# EAGLE design snake2 (EAGLE 5.06)
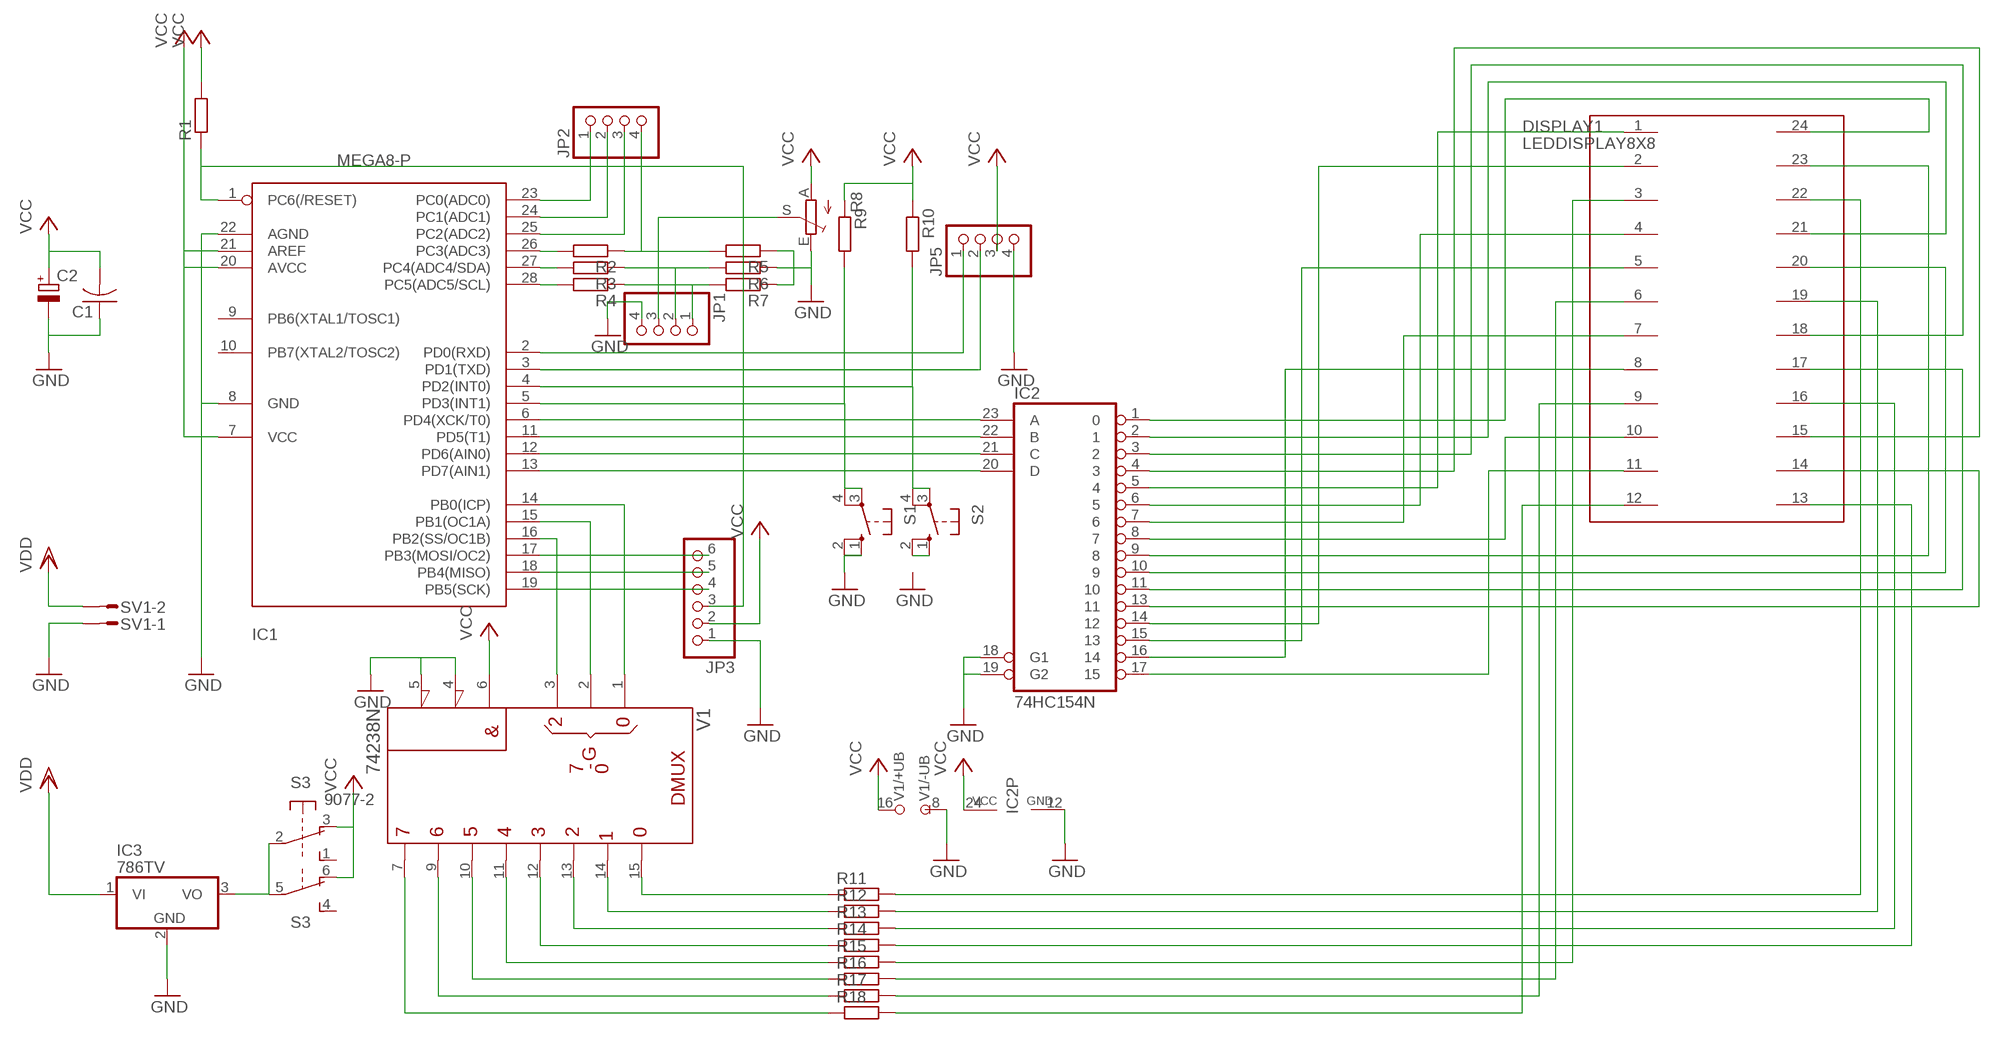
[diagram p0: schematic, sheet 1]

## Parts
C1  C-US050-025X075  [C050-025X075]
C2  CPOL-EUE2,5-6E  [E2,5-6E]
DISPLAY1  LEDDISPLAY8X8  [LEDDISPLAY8X8]
IC1  MEGA8-P  [DIL28-3]
IC2  74HC154N  [DIL24-6]
IC3  786TV  [TO220V]
JP1  PINHD-1X4  [1X04]
JP2  PINHD-1X4  [1X04]
JP3  PINHD-1X6  [1X06]
JP5  PINHD-1X4  [1X04]
R1  R-EU_M0805  [M0805]
R2  R-EU_0309/V  [0309V]
R3  R-EU_0309/V  [0309V]
R4  R-EU_0309/V  [0309V]
R5  R-EU_0309/V  [0309V]
R6  R-EU_0309/V  [0309V]
R7  R-EU_0309/V  [0309V]
R8  TRIM_EU-B25P  [B25P]
R9  R-EU_M0805  [M0805]
R10  R-EU_M0805  [M0805]
R11  R-EU_M0805  [M0805]
R12  R-EU_M0805  [M0805]
R13  R-EU_M0805  [M0805]
R14  R-EU_M0805  [M0805]
R15  R-EU_M0805  [M0805]
R16  R-EU_M0805  [M0805]
R17  R-EU_M0805  [M0805]
R18  R-EU_M0805  [M0805]
S1  10-XX  [B3F-10XX]
S2  10-XX  [B3F-10XX]
S3  9077-2  [9077-2]
SV1  S02P  [S02P]
V1  74238N  [DIL16]

## Nets
GND [power]: C1.1 C2.- IC1.8(GND) IC1.22(AGND) IC2.12(GND) IC2.18(G1) IC2.19(G2) IC3.2(GND) JP1.4 JP3.1 JP5.4 R5.1 R6.1 R7.1 R8.E S1.1(S) S1.2(S1) SV1.1 V1.4(!G2A) V1.5(!G2B) V1.8(-UB)
N$1: IC1.1(PC6(/RESET)) JP3.3 R1.1
N$2: IC1.26(PC3(ADC3)) R2.2
N$3: IC1.27(PC4(ADC4/SDA)) R3.2
N$4: IC1.28(PC5(ADC5/SCL)) R4.2
N$5: JP1.3 R8.S
N$6: JP2.4 R2.1 R5.2
N$7: JP1.2 R3.1 R6.2
N$8: JP1.1 R4.1 R7.2
N$9: IC1.23(PC0(ADC0)) JP2.1
N$10: IC1.24(PC1(ADC1)) JP2.2
N$11: IC1.25(PC2(ADC2)) JP2.3
N$12: IC1.13(PD7(AIN1)) IC2.20(D)
N$13: IC1.12(PD6(AIN0)) IC2.21(C)
N$14: IC1.11(PD5(T1)) IC2.22(B)
N$15: IC1.6(PD4(XCK/T0)) IC2.23(A)
N$16: IC1.19(PB5(SCK)) JP3.4
N$17: IC1.18(PB4(MISO)) JP3.5
N$18: IC1.17(PB3(MOSI/OC2)) JP3.6
N$19 [power]: IC3.3(VO) S3.2(1:P) S3.5(2:P)
N$20: IC1.16(PB2(SS/OC1B)) V1.3(C)
N$21: IC1.15(PB1(OC1A)) V1.2(B)
N$22: IC1.14(PB0(ICP)) V1.1(A)
N$23: IC1.5(PD3(INT1)) R9.2 S1.3(P) S1.4(P1)
N$24: DISPLAY1.22 R11.2
N$25: IC1.4(PD2(INT0)) R10.2 S2.3(P) S2.4(P1)
N$26: S2.1(S) S2.2(S1)
N$27: DISPLAY1.19 R12.2
N$28: DISPLAY1.16 R13.2
N$29: DISPLAY1.13 R14.2
N$30: DISPLAY1.3 R15.2
N$31: DISPLAY1.6 R16.2
N$32: DISPLAY1.9 R17.2
N$33: DISPLAY1.12 R18.2
N$34: DISPLAY1.24 IC2.1
N$35: DISPLAY1.23 IC2.9
N$36: DISPLAY1.21 IC2.2
N$37: DISPLAY1.20 IC2.10
N$38: DISPLAY1.18 IC2.3
N$39: DISPLAY1.17 IC2.11
N$40: DISPLAY1.15 IC2.4
N$41: DISPLAY1.14 IC2.13
N$42: DISPLAY1.1 IC2.5
N$43: DISPLAY1.2 IC2.14
N$44: DISPLAY1.4 IC2.6
N$45: DISPLAY1.5 IC2.15
N$46: DISPLAY1.7 IC2.7
N$47: DISPLAY1.8 IC2.16
N$48: DISPLAY1.10 IC2.8
N$49: DISPLAY1.11 IC2.17
N$50: R18.1 V1.7(Y7)
N$51: R17.1 V1.9(Y6)
N$52: R16.1 V1.10(Y5)
N$53: R15.1 V1.11(Y4)
N$54: R14.1 V1.12(Y3)
N$55: R13.1 V1.13(Y2)
N$56: R12.1 V1.14(Y1)
N$57: R11.1 V1.15(Y0)
N$58: IC1.2(PD0(RXD)) JP5.1
N$59: IC1.3(PD1(TXD)) JP5.2
VCC [power]: C1.2 C2.+ IC1.7(VCC) IC1.20(AVCC) IC1.21(AREF) IC2.24(VCC) JP3.2 JP5.3 R1.2 R8.A R9.1 R10.1 S3.3(1:O) S3.6(2:O) V1.6(G1) V1.16(+UB)
VDD [power]: IC3.1(VI) SV1.2
Unconnected: IC1.9(PB6(XTAL1/TOSC1)) IC1.10(PB7(XTAL2/TOSC2)) S3.1(1:S) S3.4(2:S)

## Library data of the parts
C1 = rcl:C-US: CAPACITOR, American symbol
C2 = rcl:CPOL-EU: POLARIZED CAPACITOR, European symbol
DISPLAY1 = displayled8x8:LEDDISPLAY8X8
IC1 = atmel:MEGA8-P: MICROCONTROLLER 8 Kbytes FLASH, 1 kbytes SRAM, 512 bytes EEPROM, USART, 4-channel 10 bit ADC, 2-channel 8 bit ADC Pin compatible with Atmega48, ATMega88, ATMega168 Source: avr.lbr
IC2 = 74xx-eu:74*154: 4-line to 16-line data SELECTOR/MULTIPLEXER
IC3 = linear:78*: Positive VOLTAGE REGULATOR Source: http://cache.national.com/ds/LM/LM78L05.pdf http://www.fairchildsemi.com/ds/LM/LM7805.pdf
JP1 JP2 JP5 = pinhead:PINHD-1X4: PIN HEADER
JP3 = pinhead:PINHD-1X6: PIN HEADER
R1-R7 R9-R18 = rcl:R-EU_: RESISTOR, European symbol
R8 = pot:TRIM_EU-: POTENTIOMETER
S1 S2 = switch-omron:10-XX: OMRON SWITCH
S3 = switch-misc:9077-2: MARQUARDT SWITCH
SV1 = con-amp-mt:S02P: AMP MT CONNECTOR
V1 = 74ttl-din:74*238: 1 of 8 noninverting DECODER/DEMULTIPLEXER

## Net classes
0 default: width 0.406 mm, clearance 0.254 mm
1 power: width 0.61 mm, clearance 0.254 mm to class 0, clearance 0.508 mm

## Board
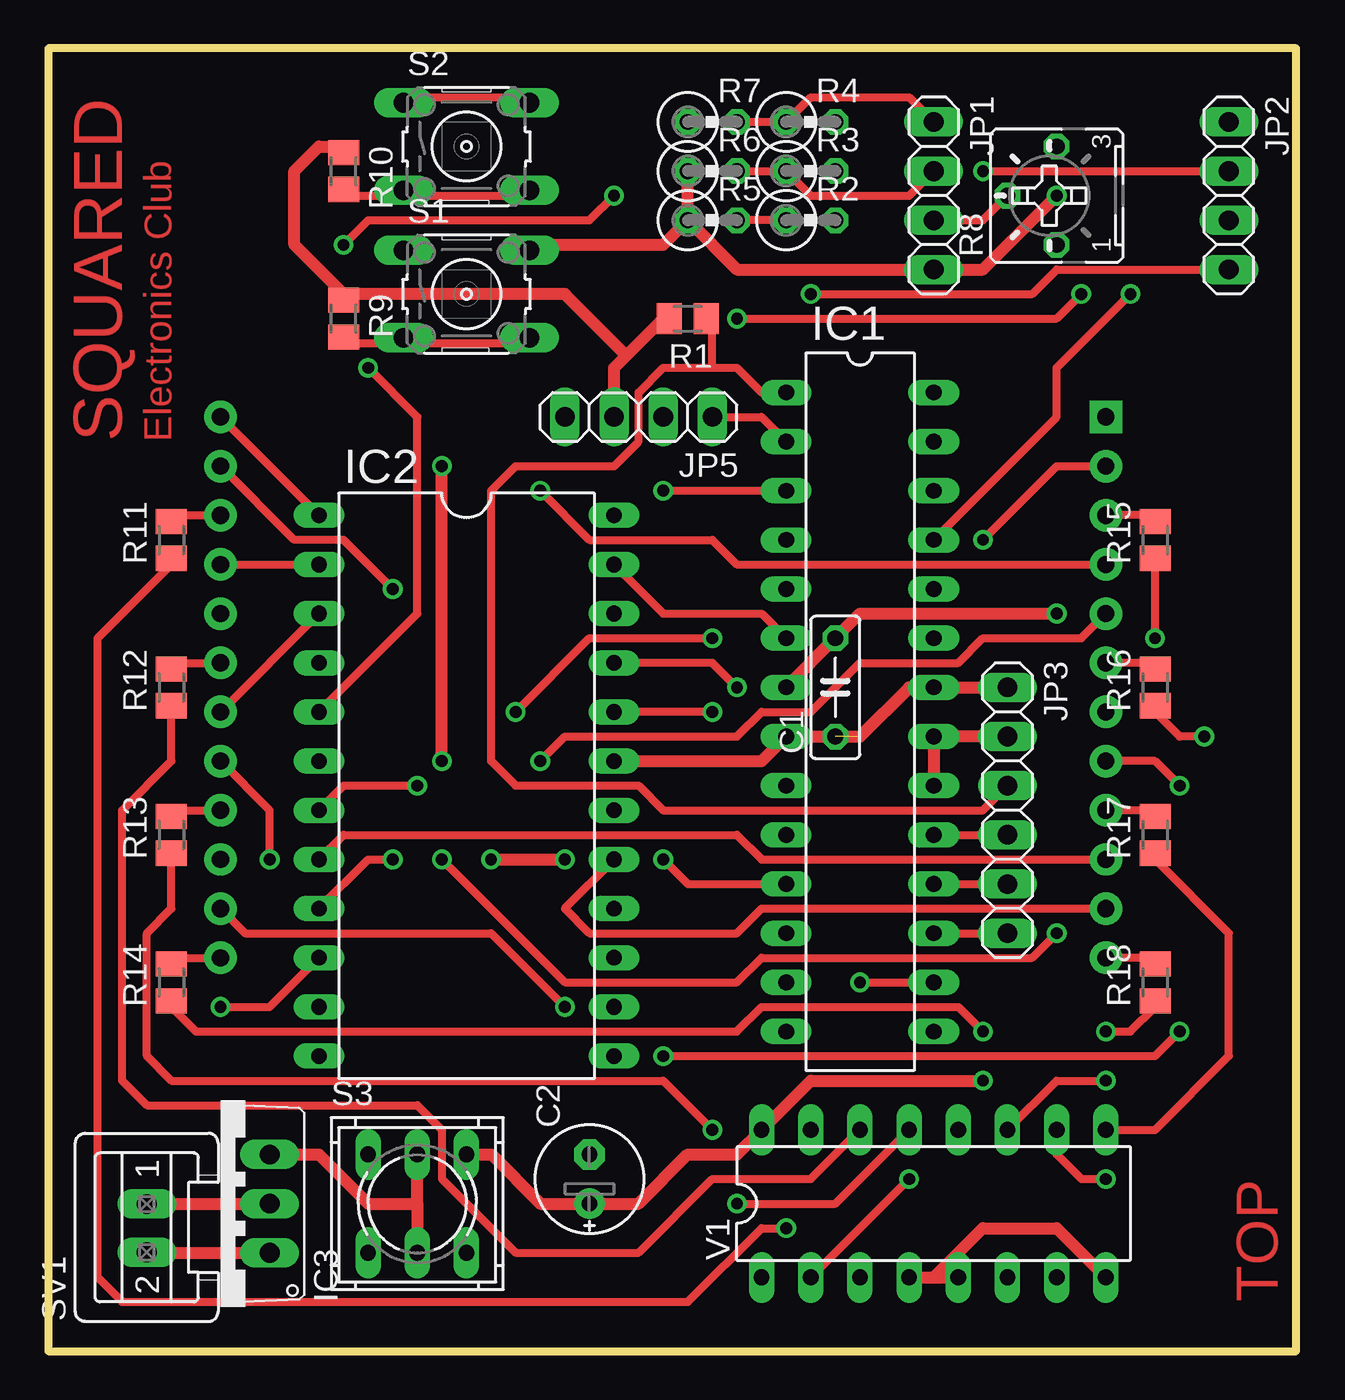
[diagram p1: board, top side]
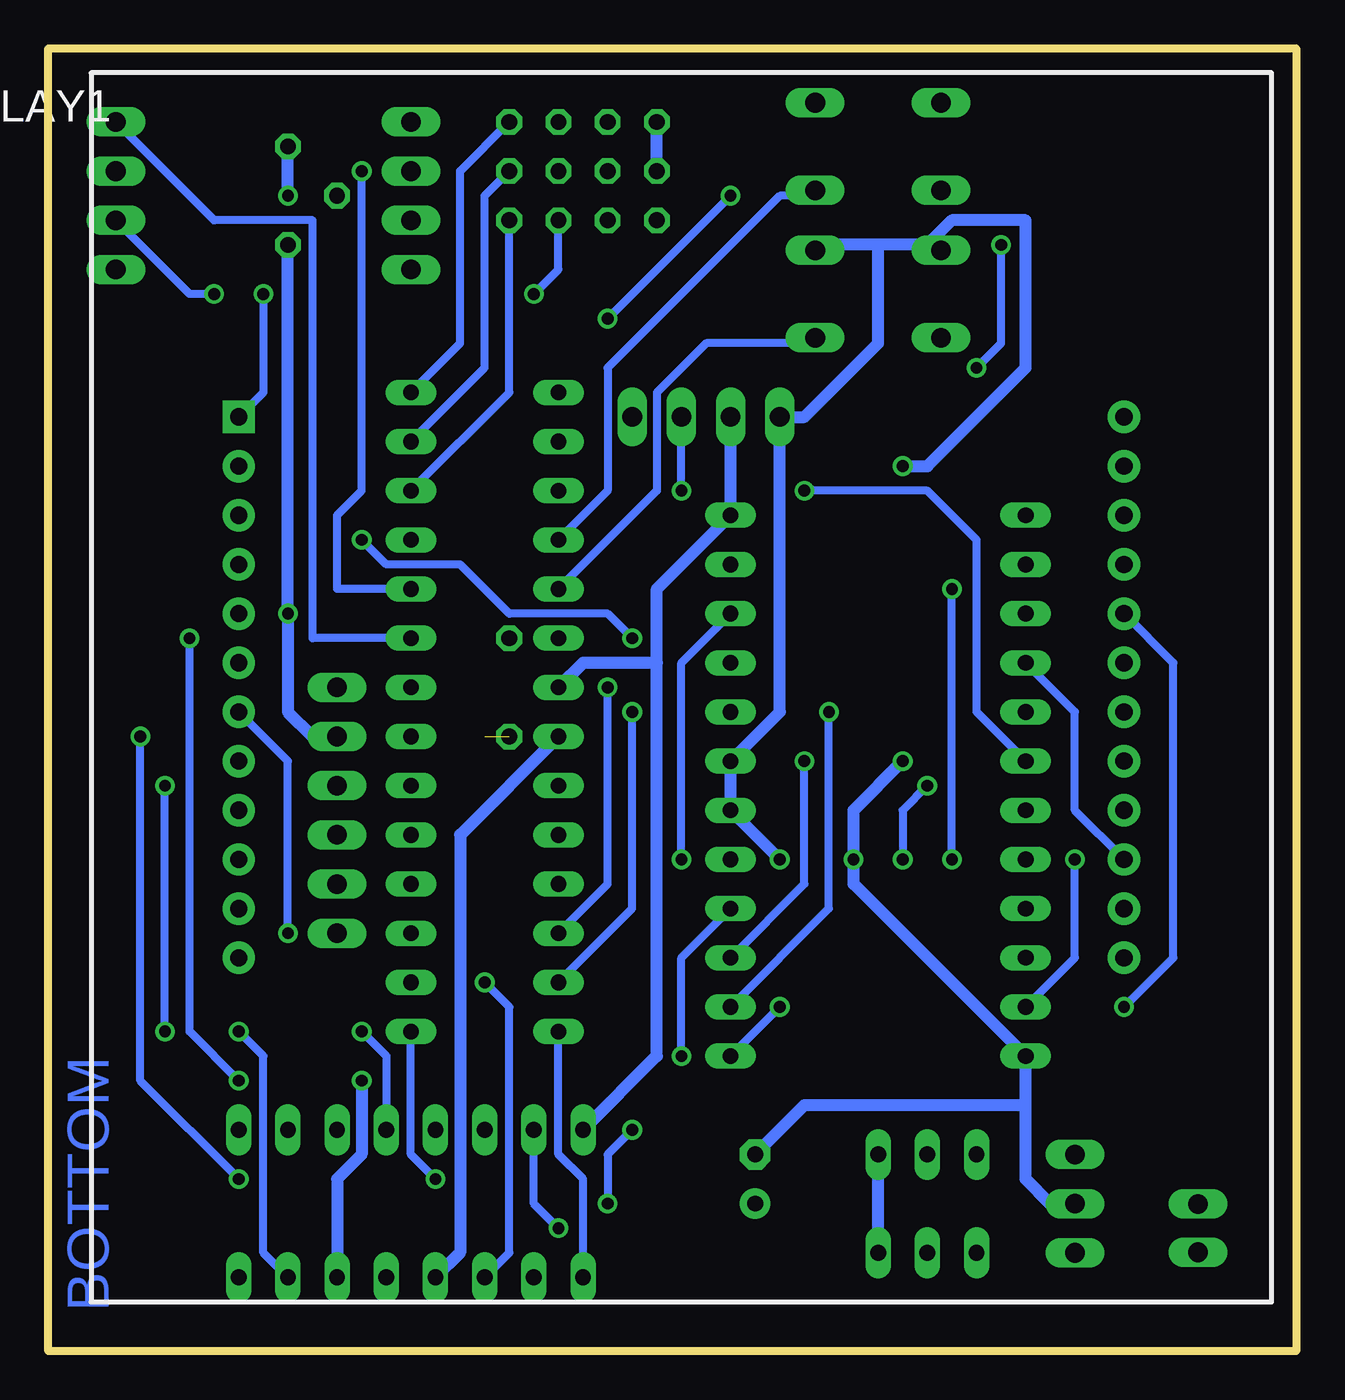
[diagram p2: board, bottom side, seen from below]

Size 64.44 x 67.3 mm. Coordinates in mm from the lower left corner, seen from the top.
Outline: 0,0 64.44,0 64.44,67.3 0,67.3 0,0
Copper layers (1*16): Top 0.035mm / dielectric 1.5mm / Bottom 0.035mm
Design rules "default *": minimum track width 10mil, minimum drill 24mil, track to track 8mil, track to pad 8mil, pad to pad 8mil, via to via 8mil, smd to smd 8mil, copper to edge 40mil, drill to drill 8mil, minimum pad ring 10mil, minimum via ring 8mil, stop-mask expansion 4mil, vias tented up to drill 0mil, thermal gap 10mil

### Footprints (pad centres in the part's own frame; a part is rotated, then mirrored left to right if it is on the bottom)
C050-025X075 = drill 0.813 octagon: 1 -2.54,0; 2 2.54,0
E2,5-6E = drill 0.813 pad 1.575 round: + -1.27,0 | drill 0.813 pad 1.575 octagon: - 1.27,0
LEDDISPLAY8X8 = drill 0.889 pad 1.676 square: 1 0,0 | drill 0.889 pad 1.676 round: 2 0,-2.54; 3 0,-5.08; 4 0,-7.62; 5 0,-10.16; 6 0,-12.7; 7 0,-15.24; 8 0,-17.78; 9 0,-20.32; 10 0,-22.86; 11 0,-25.4; 12 0,-27.94; 13 45.72,-27.94; 14 45.72,-25.4; 15 45.72,-22.86; 16 45.72,-20.32; 17 45.72,-17.78; 18 45.72,-15.24; 19 45.72,-12.7; 20 45.72,-10.16; 21 45.72,-7.62; 22 45.72,-5.08; 23 45.72,-2.54; 24 45.72,0
DIL28-3 = drill 0.813 long: 1 -16.51,-3.81; 2 -13.97,-3.81; 3 -11.43,-3.81; 4 -8.89,-3.81; 5 -6.35,-3.81; 6 -3.81,-3.81; 7 -1.27,-3.81; 8 1.27,-3.81; 9 3.81,-3.81; 10 6.35,-3.81; 11 8.89,-3.81; 12 11.43,-3.81; 13 13.97,-3.81; 14 16.51,-3.81; 15 16.51,3.81; 16 13.97,3.81; 17 11.43,3.81; 18 8.89,3.81; 19 6.35,3.81; 20 3.81,3.81; 21 1.27,3.81; 22 -1.27,3.81; 23 -3.81,3.81; 24 -6.35,3.81; 25 -8.89,3.81; 26 -11.43,3.81; 27 -13.97,3.81; 28 -16.51,3.81
DIL24-6 = drill 0.813 long: 1 -13.97,-7.62; 2 -11.43,-7.62; 3 -8.89,-7.62; 4 -6.35,-7.62; 5 -3.81,-7.62; 6 -1.27,-7.62; 7 1.27,-7.62; 8 3.81,-7.62; 9 6.35,-7.62; 10 8.89,-7.62; 11 11.43,-7.62; 12 13.97,-7.62; 13 13.97,7.62; 14 11.43,7.62; 15 8.89,7.62; 16 6.35,7.62; 17 3.81,7.62; 18 1.27,7.62; 19 -1.27,7.62; 20 -3.81,7.62; 21 -6.35,7.62; 22 -8.89,7.62; 23 -11.43,7.62; 24 -13.97,7.62
TO220V = drill 1.016 long: 1 -2.54,-2.54; 2 0,-2.54; 3 2.54,-2.54
1X04 = drill 1.016 long: 1 -3.81,0; 2 -1.27,0; 3 1.27,0; 4 3.81,0
1X06 = drill 1.016 long: 1 -6.35,0; 2 -3.81,0; 3 -1.27,0; 4 1.27,0; 5 3.81,0; 6 6.35,0
M0805 = smd 1.3 x 1.6: 1 -0.95,0; 2 0.95,0
0309V = drill 0.813 octagon: 1 -1.27,0; 2 1.27,0
B25P = drill 0.813 octagon: A -2.54,0; E 2.54,0; S 0,2.54
B3F-10XX = drill 1.016 long: 1 -3.251,2.261; 2 3.251,2.261; 3 -3.251,-2.261; 4 3.251,-2.261
9077-2 = drill 0.813 long: 1 -2.54,2.54; 2 0,2.54; 3 2.54,2.54; 4 -2.54,-2.54; 5 0,-2.54; 6 2.54,-2.54
S02P = drill 1.016 long: 1 1.25,0; 2 -1.25,0
DIL16 = drill 0.813 long: 1 -8.89,-3.81; 2 -6.35,-3.81; 3 -3.81,-3.81; 4 -1.27,-3.81; 5 1.27,-3.81; 6 3.81,-3.81; 7 6.35,-3.81; 8 8.89,-3.81; 9 8.89,3.81; 10 6.35,3.81; 11 3.81,3.81; 12 1.27,3.81; 13 -1.27,3.81; 14 -3.81,3.81; 15 -6.35,3.81; 16 -8.89,3.81

### Placement (x,y rotation side)
C1  40.64,34.29 90 top
C2  27.94,8.89 90 top
DISPLAY1  54.61,48.26 0 bottom
IC1  41.91,33.02 270 top
IC2  21.59,29.21 270 top
IC3  8.89,7.62 90 top
JP1  45.72,59.69 270 top
JP2  60.96,59.69 270 top
JP3  49.53,27.94 270 top
JP5  30.48,48.26 180 top
R1  33.02,53.34 180 top
R2  39.37,58.42 0 top
R3  39.37,60.96 0 top
R4  39.37,63.5 0 top
R5  34.29,58.42 0 top
R6  34.29,60.96 0 top
R7  34.29,63.5 0 top
R8  52.07,59.69 90 top
R9  15.24,53.34 270 top
R10  15.24,60.96 270 top
R11  6.35,41.91 90 top
R12  6.35,34.29 90 top
R13  6.35,26.67 90 top
R14  6.35,19.05 90 top
R15  57.15,41.91 90 top
R16  57.15,34.29 90 top
R17  57.15,26.67 90 top
R18  57.15,19.05 90 top
S1  21.59,54.61 0 top
S2  21.59,62.23 0 top
S3  19.05,7.62 0 top
SV1  5.08,6.35 90 top
V1  45.72,7.62 0 top

### Tracks (layer width: path | path; a pad name or v marks a point on that pad's centre or on a via)
GND  (via drill 0.61)  (1 unrouted)
  Top 0.61: R5.1 R6.1 | R5.1 31.75,57.15 25.4,57.15 S1.2 | 45.72,3.81 V1.5 | V1.4 45.72,3.81 | V1.8 52.07,6.35 48.26,6.35 45.72,3.81 | JP3.1 IC1.22 44.45,34.29 41.91,31.75 IC1.8 36.83,30.48 IC2.19 | v22.86,25.4 v26.67,25.4 | IC3.2 5.1,7.62 SV1.1 | v52.07,59.69 48.26,55.88 JP1.4 35.56,55.88 R5.1 | v20.32,30.48 v20.32,45.72
  Bottom 0.61: R6.1 R7.1 | S1.2 24.13,57.15 21.59,57.15 | 13.97,12.7 13.97,8.89 12.7,7.62 IC3.2 | 13.97,12.7 IC2.12 22.86,24.13 v22.86,25.4 22.86,27.94 v20.32,30.48 | V1.4 43.18,5.08 43.18,26.67 IC1.8 | v26.67,25.4 IC2.18 IC2.19 26.67,33.02 JP5.4 25.4,48.26 21.59,52.07 21.59,57.15 | 19.05,57.15 21.59,57.15 | v52.07,59.69 R8.E | 19.05,57.15 17.78,58.42 13.97,58.42 13.97,50.8 19.05,45.72 v20.32,45.72 | C2.- 25.4,12.7 13.97,12.7 | 19.05,57.15 S1.1
N$1
  Top 0.406: IC1.1 36.83,49.53 35.56,50.8 34.29,50.8 | JP3.3 48.26,27.94 31.75,27.94 30.48,29.21 24.13,29.21 22.86,30.48 22.86,44.45 24.13,45.72 29.21,45.72 30.48,46.99 30.48,49.53 31.75,50.8 34.29,50.8 | R1.1 34.29,53.02 34.29,50.8
N$2
  Bottom 0.406: IC1.26 40.64,49.53 R2.2
N$3
  Bottom 0.406: IC1.27 41.91,50.8 41.91,59.69 R3.2
N$4
  Bottom 0.406: IC1.28 43.18,52.07 43.18,60.96 R4.2
N$5
  Top 0.406: R8.S 48.26,58.42 JP1.3
N$6  (via drill 0.61)
  Top 0.406: R2.1 R5.2 | JP2.4 52.07,55.88 50.8,54.61 v39.37,54.61
  Bottom 0.406: v39.37,54.61 38.1,55.88 R2.1
N$7
  Top 0.406: R6.2 R3.1 39.37,59.69 44.45,59.69 JP1.2
N$8
  Top 0.406: R7.2 R4.1 39.37,64.77 44.45,64.77 JP1.1
N$9
  Bottom 0.406: IC1.23 50.8,36.83 50.8,58.42 55.88,58.42 JP2.1
N$10  (via drill 0.61)
  Top 0.406: v48.26,60.96 JP2.2
  Bottom 0.406: IC1.24 49.53,39.37 49.53,43.18 48.26,44.45 v48.26,60.96
N$11  (via drill 0.61)
  Top 0.406: IC1.25 52.07,48.26 52.07,50.8 v55.88,54.61
  Bottom 0.406: JP2.3 57.15,54.61 v55.88,54.61
N$12  (via drill 0.61)
  Top 0.406: v34.29,33.02 IC2.20
  Bottom 0.406: IC1.13 34.29,22.86 v34.29,33.02
N$13  (via drill 0.61)
  Top 0.406: v35.56,34.29 34.29,35.56 IC2.21
  Bottom 0.406: IC1.12 35.56,24.13 v35.56,34.29
N$14  (via drill 0.61)
  Top 0.406: IC1.11 33.02,24.13 v31.75,25.4
  Bottom 0.406: v31.75,25.4 31.75,35.56 IC2.22
N$15
  Top 0.406: IC2.23 31.75,38.1 36.83,38.1 IC1.6
N$16
  Top 0.406: IC1.19 JP3.4
N$17
  Top 0.406: IC1.18 JP3.5
N$18
  Top 0.406: IC1.17 JP3.6
N$19
  Top 0.61: 19.05,7.62 S3.2 | 19.05,7.62 S3.5 | IC3.3 13.97,10.16 16.51,7.62 19.05,7.62
N$20  (via drill 0.61)
  Top 0.406: v41.91,19.05 IC1.16
  Bottom 0.406: V1.3 40.64,5.08 40.64,17.78 v41.91,19.05
N$21  (via drill 0.61)
  Top 0.406: V1.2 v44.45,8.89
  Bottom 0.406: v44.45,8.89 45.72,10.16 IC1.15
N$22
  Bottom 0.406: V1.1 36.83,8.89 38.1,10.16 IC1.14
N$23
  Top 0.406: R9.2 15.24,52.07 17.78,52.07 S1.3 19.05,52.07 24.13,52.07 S1.4
  Bottom 0.406: IC1.5 33.02,44.45 33.02,49.53 30.48,52.07 25.4,52.07 S1.4
N$24
  Top 0.406: DISPLAY1.22 6.35,43.18 R11.2
N$25
  Top 0.406: R10.2 15.24,59.69 17.78,59.69 S2.3 19.05,59.69 24.13,59.69 S2.4
  Bottom 0.406: IC1.4 35.56,44.45 35.56,50.8 26.67,59.69 25.4,59.69 S2.4
N$26
  Top 0.406: S2.1 19.05,64.77 24.13,64.77 S2.2
N$27
  Top 0.406: DISPLAY1.19 6.35,35.56 R12.2
N$28
  Top 0.406: DISPLAY1.16 6.35,27.94 R13.2
N$29
  Top 0.406: DISPLAY1.13 6.35,20.32 R14.2
N$30
  Top 0.406: DISPLAY1.3 57.15,43.18 R15.2
N$31
  Top 0.406: DISPLAY1.6 57.15,35.56 R16.2
N$32
  Top 0.406: DISPLAY1.9 57.15,27.94 R17.2
N$33
  Top 0.406: DISPLAY1.12 57.15,20.32 R18.2
N$34
  Top 0.406: DISPLAY1.24 IC2.1
N$35  (via drill 0.61)
  Top 0.406: IC2.9 16.51,25.4 v17.78,25.4 | v17.78,39.37 15.24,41.91 12.7,41.91 DISPLAY1.23
  Bottom 0.406: v17.78,25.4 v17.78,39.37
N$36
  Top 0.406: DISPLAY1.21 IC2.2
N$37  (via drill 0.61)
  Top 0.406: IC2.10 11.43,17.78 v8.89,17.78
  Bottom 0.406: v8.89,17.78 6.35,20.32 6.35,35.56 DISPLAY1.20
N$38
  Top 0.406: DISPLAY1.18 IC2.3
N$39  (via drill 0.61)
  Top 0.406: v11.43,25.4 11.43,27.94 DISPLAY1.17
  Bottom 0.406: IC2.11 11.43,20.32 v11.43,25.4
N$40
  Bottom 0.406: IC2.4 11.43,33.02 11.43,27.94 DISPLAY1.15
N$41  (via drill 0.61)
  Top 0.406: v26.67,17.78 22.86,21.59 10.16,21.59 DISPLAY1.14
  Bottom 0.406: v26.67,17.78 IC2.13
N$42  (via drill 0.61)
  Top 0.406: IC2.5 19.05,38.1 19.05,48.26 v16.51,50.8 | v15.24,57.15 16.51,58.42 27.94,58.42 v29.21,59.69 | v53.34,54.61 52.07,53.34 v35.56,53.34
  Bottom 0.406: v16.51,50.8 15.24,52.07 v15.24,57.15 | DISPLAY1.1 53.34,49.53 v53.34,54.61 | v29.21,59.69 v35.56,53.34
N$43  (via drill 0.61, 0.61 pad 1.02)
  Top 0.406: v24.13,33.02 27.94,36.83 v34.29,36.83 | v48.26,41.91 52.07,45.72 DISPLAY1.2
  Bottom 0.406: IC2.14 24.13,22.86 v24.13,33.02 | v34.29,36.83 35.56,38.1 40.64,38.1 43.18,40.64 46.99,40.64 v48.26,41.91
N$44  (via drill 0.61)
  Top 0.406: v25.4,44.45 27.94,41.91 34.29,41.91 35.56,40.64 DISPLAY1.4
  Bottom 0.406: IC2.6 16.51,33.02 16.51,41.91 19.05,44.45 v25.4,44.45
N$45  (via drill 0.61)
  Top 0.406: v25.4,30.48 26.67,31.75 35.56,31.75 36.83,33.02 39.37,33.02 41.91,35.56 46.99,35.56 48.26,36.83 53.34,36.83 DISPLAY1.5
  Bottom 0.406: IC2.15 25.4,24.13 v25.4,30.48
N$46  (via drill 0.61)
  Top 0.406: IC2.7 15.24,29.21 v19.05,29.21 | v20.32,25.4 26.67,19.05 35.56,19.05 36.83,20.32 50.8,20.32 v52.07,21.59
  Bottom 0.406: v19.05,29.21 20.32,27.94 v20.32,25.4 | v52.07,21.59 52.07,30.48 DISPLAY1.7
N$47  (via drill 0.61)
  Top 0.406: v31.75,15.24 57.15,15.24 v58.42,16.51 | v58.42,29.21 57.15,30.48 DISPLAY1.8
  Bottom 0.406: IC2.16 31.75,20.32 v31.75,15.24 | v58.42,16.51 v58.42,29.21
N$48
  Top 0.406: IC2.8 15.24,26.67 35.56,26.67 36.83,25.4 DISPLAY1.10
N$49
  Top 0.406: IC2.17 26.67,22.86 27.94,21.59 35.56,21.59 36.83,22.86 DISPLAY1.11
N$50  (via drill 0.61)
  Top 0.406: v54.61,16.51 55.88,16.51 57.15,17.78 R18.1
  Bottom 0.406: v54.61,16.51 53.34,15.24 53.34,5.08 V1.7
N$51
  Top 0.406: V1.9 57.15,11.43 60.96,15.24 60.96,21.59 57.15,25.4 R17.1
N$52  (via drill 0.61)
  Top 0.406: v59.69,31.75 58.42,31.75 57.15,33.02 R16.1 | v54.61,8.89 53.34,8.89 52.07,10.16 V1.10
  Bottom 0.406: v59.69,31.75 59.69,13.97 v54.61,8.89
N$53  (via drill 0.61)
  Top 0.406: v54.61,13.97 52.07,13.97 V1.11 | v57.15,36.83 R15.1
  Bottom 0.406: v57.15,36.83 57.15,16.51 v54.61,13.97
N$54  (via drill 0.61)
  Top 0.406: v48.26,16.51 46.99,17.78 36.83,17.78 35.56,16.51 7.62,16.51 6.35,17.78 R14.1
  Bottom 0.406: v48.26,16.51 46.99,15.24 V1.12
N$55  (via drill 0.61)
  Top 0.406: v34.29,11.43 31.75,13.97 6.35,13.97 5.08,15.24 5.08,21.59 6.35,22.86 R13.1 | v35.56,7.62 40.64,7.62 V1.13
  Bottom 0.406: v34.29,11.43 35.56,10.16 v35.56,7.62
N$56
  Top 0.406: V1.14 39.37,8.89 34.29,8.89 30.48,5.08 24.13,5.08 20.32,8.89 20.32,11.43 19.05,12.7 5.08,12.7 3.81,13.97 3.81,27.94 6.35,30.48 R12.1
N$57  (via drill 0.61)
  Top 0.406: v38.1,6.35 36.83,6.35 33.02,2.54 3.81,2.54 2.54,3.81 2.54,36.83 6.35,40.64 R11.1
  Bottom 0.406: v38.1,6.35 39.37,7.62 V1.15
N$58
  Top 0.406: IC1.2 36.83,48.26 JP5.1
N$59  (via drill 0.61)
  Top 0.406: v31.75,44.45 IC1.3
  Bottom 0.406: v31.75,44.45 JP5.2
VCC  (via drill 0.61)
  Top 0.61: S3.3 22.86,10.16 25.4,7.62 C2.+ 30.48,7.62 33.02,10.16 35.56,10.16 V1.16 39.37,13.97 v48.26,13.97 | IC1.20 IC1.21 JP3.2 | 15.24,54.61 12.7,57.15 12.7,60.96 13.97,62.23 15.24,62.23 R10.1 | 15.24,54.61 26.67,54.61 29.84,51.44 | 15.24,54.61 R9.1 | v52.07,38.1 41.91,38.1 C1.2 IC1.7 | 29.84,51.44 29.21,50.8 JP5.3 | 29.84,51.44 31.75,53.34 R1.2
  Bottom 0.61: S3.6 S3.3 | V1.6 49.53,8.89 48.26,10.16 v48.26,13.97 | JP3.2 50.8,31.75 52.07,33.02 v52.07,38.1 R8.A | JP5.3 IC2.24 33.02,39.37 33.02,35.56 | IC1.7 36.83,35.56 33.02,35.56 | V1.16 33.02,15.24 33.02,35.56
VDD
  Top 0.61: IC3.1 5.1,5.08 SV1.2

### Text on the board
Top: SQUARED | Electronics Club | TOP
Bottom: BOTTOM